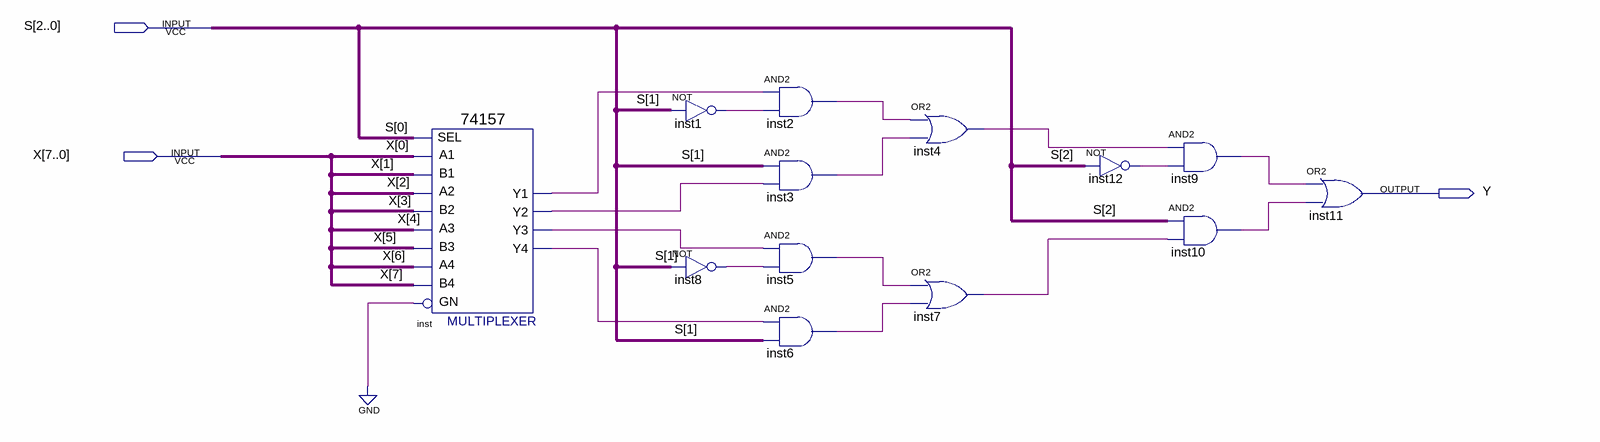
[diagram p0: schematic sheet]
// Quartus schematic Mux8_1.bdf as structural Verilog: 13 symbols, 3 pins
module Mux8_1 (
  input  [2:0] S,
  input  [7:0] X,
  output Y
);

  wire inst1_out, inst2_out, inst3_out, inst4_out, inst5_out, inst6_out, inst7_out, inst8_out, inst9_out,
       inst10_out, inst12_out, inst_y1, inst_y2, inst_y3, inst_y4;

  \74157  inst (
    .A1(X[0]), .B1(X[1]), .SEL(S[0]), .B2(X[3]), .A3(X[4]), .B3(X[5]), .A2(X[2]), .B4(X[7]), .GN(1'b0),
    .A4(X[6]), .Y2(inst_y2), .Y1(inst_y1), .Y4(inst_y4), .Y3(inst_y3));
  not inst1 (inst1_out, S[1]);
  not inst8 (inst8_out, S[1]);
  and inst2 (inst2_out, inst_y1, inst1_out);
  and inst3 (inst3_out, S[1], inst_y2);
  and inst5 (inst5_out, inst_y3, inst8_out);
  and inst6 (inst6_out, inst_y4, S[1]);
  or inst4 (inst4_out, inst2_out, inst3_out);
  or inst7 (inst7_out, inst5_out, inst6_out);
  not inst12 (inst12_out, S[2]);
  and inst9 (inst9_out, inst4_out, inst12_out);
  and inst10 (inst10_out, S[2], inst7_out);
  or inst11 (Y, inst9_out, inst10_out);
endmodule
